# EAGLE design board (EAGLE 9.6.2)
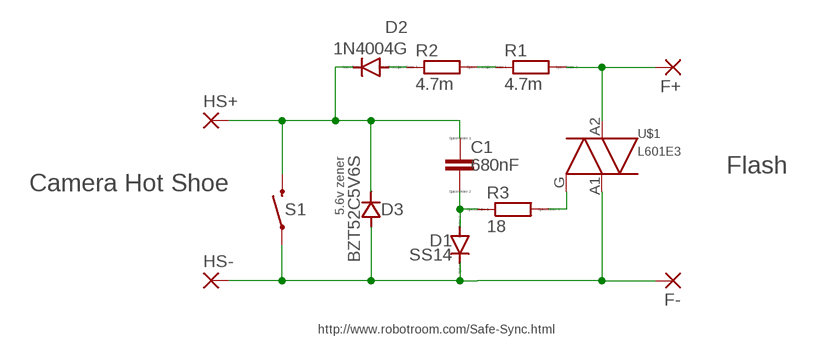
[diagram p0: schematic, sheet 1]

## Parts
C1  680nF  CC0603  [C0603]
D1  SS14  DIODE-DO214AC  [DO214AC]
D2  1N4004G  DIODE-DO214AC  [DO214AC]
D3  BZT52C5V6S  DSOD323  [SOD323]
F+  1,6/0,8  [1,6/0,8]
F-  1,6/0,8  [1,6/0,8]
HS+  1,6/0,8  [1,6/0,8]
HS-  1,6/0,8  [1,6/0,8]
R1  4.7m  RR0603  [R0603]
R2  4.7m  RR0603  [R0603]
R3  18  RR0603  [R0603]
S1  MOMENTARY-SWITCH-SPST-SMD-6.0X3.5MM  [TACTILE_SWITCH_SMD_6.0X3.5MM]
U$1  L601E3  [TO92E]

## Nets
N$1: R1.1 R2.2
N$2: F+.1(P) R1.2 U$1.A2
N$3: D1.C D3.2(A) F-.1(P) HS-.1(P) S1.1 U$1.A1
N$4: R3.2 U$1.G
N$5: C1.2 D1.A R3.1
N$6: C1.1 D2.C D3.1(C) HS+.1(P) S1.2
N$7: D2.A R2.1

## Notes on the sheet
- 5.6v zener
- Camera Hot Shoe | Flash
- http://www.robotroom.com/Safe-Sync.html

## Library data of the parts
C1 = eagle-ltspice:C: CAPACITOR, European symbol; SPICEMODEL: NONE; SPICEPREFIX: C
D1 D2 = diode:DIODE-: DIODE
D3 = zetex:D: DIODE; MPN: CDSOD323-T05C; OC_FARNELL: 1824860; OC_NEWARK: 79R6078
F+ F- HS+ HS- = wirepad:1,6/0,8: THROUGH-HOLE PAD
R1-R3 = eagle-ltspice:R: RESISTOR, European symbol; SPICEMODEL: NONE; SPICEPREFIX: R
S1 = SparkFun-Switches:MOMENTARY-SWITCH-SPST: Momentary Switch (Pushbutton) - SPST Normally-open (NO) SPST momentary switches (buttons, pushbuttons). Variants PTH-12MM - 12mm square, through-hole Momentary Pushbutton Switch - 12mm Square <https://www.sparkfun.com/products/9190> (COM-09190) PTH-6.0MM, PTH-6.0MM-KIT - 6.0mm square, through-hole Mini Pushbutton Switch <https://www.sparkfun.com/products/97> (COM-00097) KIT package intended for soldering kit's - only one side of pads' copper is exposed. PTH-RIGHT-ANGLE-KIT - Right-angle, through-hole Right Angle Tactile Button <https://www.sparkfun.com/products/10791> - Used on SparkFun BigTime Watch Kit <https://www.sparkfun.com/products/11734> SMD-12MM - 12mm square, surface-mount Tactile Button - SMD (12mm) <https://www.sparkfun.com/products/12993> (COM-12993) Used on SparkFun PicoBoard <https://www.sparkfun.com/products/11888> SMD-4.5MM - 4.5mm Square Trackball Switch Used on SparkFun Blackberry Trackballer Breakout <https://www.sparkfun.com/products/13169> SMD-4.6MMX2.8MM - 4.60mm x 2.80mm, surface mount Used on SparkFun SAMD21 Mini Breakout <https://www.sparkfun.com/products/13664> SMD-5.2MM, SMD-5.2-REDUNDANT - 5.2mm square, surface-mount Mini Pushbutton Switch - SMD <https://www.sparkfun.com/products/8720> (COM-08720) Used on Arduino Pro Mini <https://www.sparkfun.com/products/11114> REDUNDANT package connects both switch circuits together SMD-6.0X3.5MM - 6.0 x 3.5mm, surface mount Momentary Reset Switch SMD <https://www.sparkfun.com/products/8229> (COM-08229) SMD-6.2MM-TALL - 6.2mm square, surface mount Tactile Button - SMD (6mm) <https://www.sparkfun.com/products/12992> Used on SparkFun Digital Sandbox <https://www.sparkfun.com/products/12651> SMD-RIGHT-ANGLE - Right-angle, surface mount Used on SparkFun Block for Intel® Edison - Arduino <https://www.sparkfun.com/products/13036>; PROD_ID: SWCH-00815; SF_SKU: COM-08229
U$1 = personal:L601E3

## Board
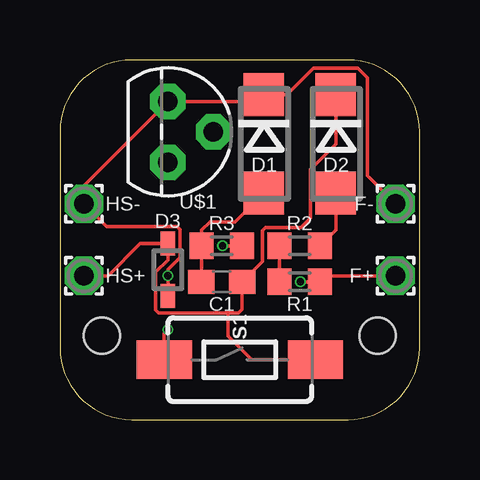
[diagram p1: board, top side]
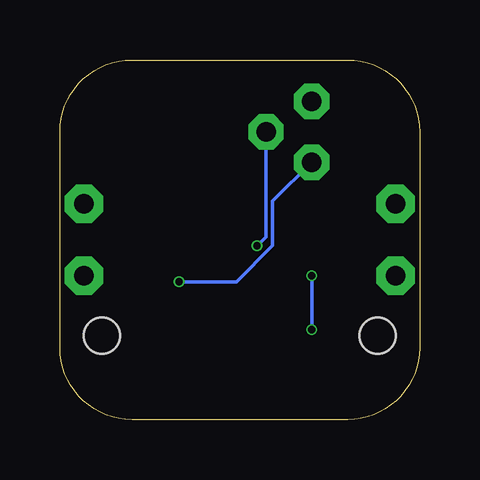
[diagram p2: board, bottom side, seen from below]

Size 15 x 15 mm. Coordinates in mm from the lower left corner, seen from the top.
Outline: 0,12 0,3 arc90 3,0 12,0 arc90 15,3 15,12 arc90 12,15 3,15 arc90 0,12
Copper layers (1*16): Top 0.035mm / dielectric 1.6mm / Bottom 0.035mm
Design rules "jlcpcb-2layers *": minimum track width 5mil, minimum drill 0.3mm, track to track 5mil, track to pad 5mil, pad to pad 5mil, via to via 5mil, smd to smd 5mil, copper to edge 0.2mm, drill to drill 6mil, minimum pad ring 10mil, minimum via ring 3mil, stop-mask expansion 4mil, vias tented up to drill 0.5mm, thermal gap 10mil
Holes 1.5 mm at 1.75,3.5 13.25,3.5

### Footprints (pad centres in the part's own frame; a part is rotated, then mirrored left to right if it is on the bottom)
C0603 = smd 1.1 x 1: 1 -0.85,0; 2 0.85,0
DO214AC = smd 1.8 x 1.7: A 2.05,0; C -2.05,0
SOD323 = smd 1 x 0.6: 1 -1.1,0; 2 1.1,0
1,6/0,8 = drill 0.813 pad 1.6 octagon: 1 0,0
R0603 = smd 1 x 1.1: 1 -0.85,0; 2 0.85,0
TACTILE_SWITCH_SMD_6.0X3.5MM = smd 2.3 x 1.6: 1 -3.15,0; 2 3.15,0
TO92E = drill 0.813 octagon: A1 -1.27,0; A2 1.27,0; G 0,1.905

### Placement (x,y rotation side)
C1  6.75,5.75 180 top
D1  8.5,11.5 270 top
D2  11.5,11.5 270 top
D3  4.5,6.25 270 top
F+  14,6 0 top
F-  14,9 0 top
HS+  1,6 0 top
HS-  1,9 0 top
R1  10,5.75 0 top
R2  10,7.25 180 top
R3  6.75,7.25 0 top
S1  7.5,2.5 0 top
U$1  4.5,12 270 top

### Tracks (layer width: path | path; a pad name or v marks a point on that pad's centre or on a via)
N$1
  Top 0.152: R1.1 R2.2
N$2  (via drill 0.3)
  Top 0.152: F+.1 11.1,6 R1.2 v10.03,5.75
  Bottom 0.152: U$1.A2 6.13,9.1 6.13,7.26 7.64,5.75 v10.03,5.75
N$3  (via drill 0.3)
  Top 0.152: D3.2 v4.5,6 4.5,6.26 5,6.77 5,7.93 4.88,8.05 1.95,8.05 HS-.1 1,9.77 U$1.A1 8.22,13.27 D1.C 9.46,13.55 10.57,14.65 12.43,14.65 12.83,14.26 12.83,10.17 F-.1 | S1.1 4.35,3.6 v4.5,3.75
  Bottom 0.152: v4.5,3.75 v4.5,6
N$4  (via drill 0.3)
  Top 0.152: R3.2 v6.78,7.25
  Bottom 0.152: v6.78,7.25 6.41,7.62 U$1.G
N$5
  Top 0.152: C1.2 R3.1 5.9,7.9 6.25,8.25 7.3,8.25 D1.A
N$6
  Top 0.152: HS+.1 2,6 3.35,7.35 D3.1 4.5,6.66 4,6.16 4,4.57 4.12,4.45 7,4.45 | 7,4.45 7.45,4.45 7.6,4.6 C1.1 8.45,6.6 8.45,7.88 8.57,8 10.05,8 10.45,8.4 10.45,10.43 11.5,11.49 D2.C | S1.2 8,2.5 7,3.5 7,4.45
N$7
  Top 0.152: D2.A 11.5,7.9 R2.1